# EAGLE design LightSwitch (EAGLE 8.7.0)
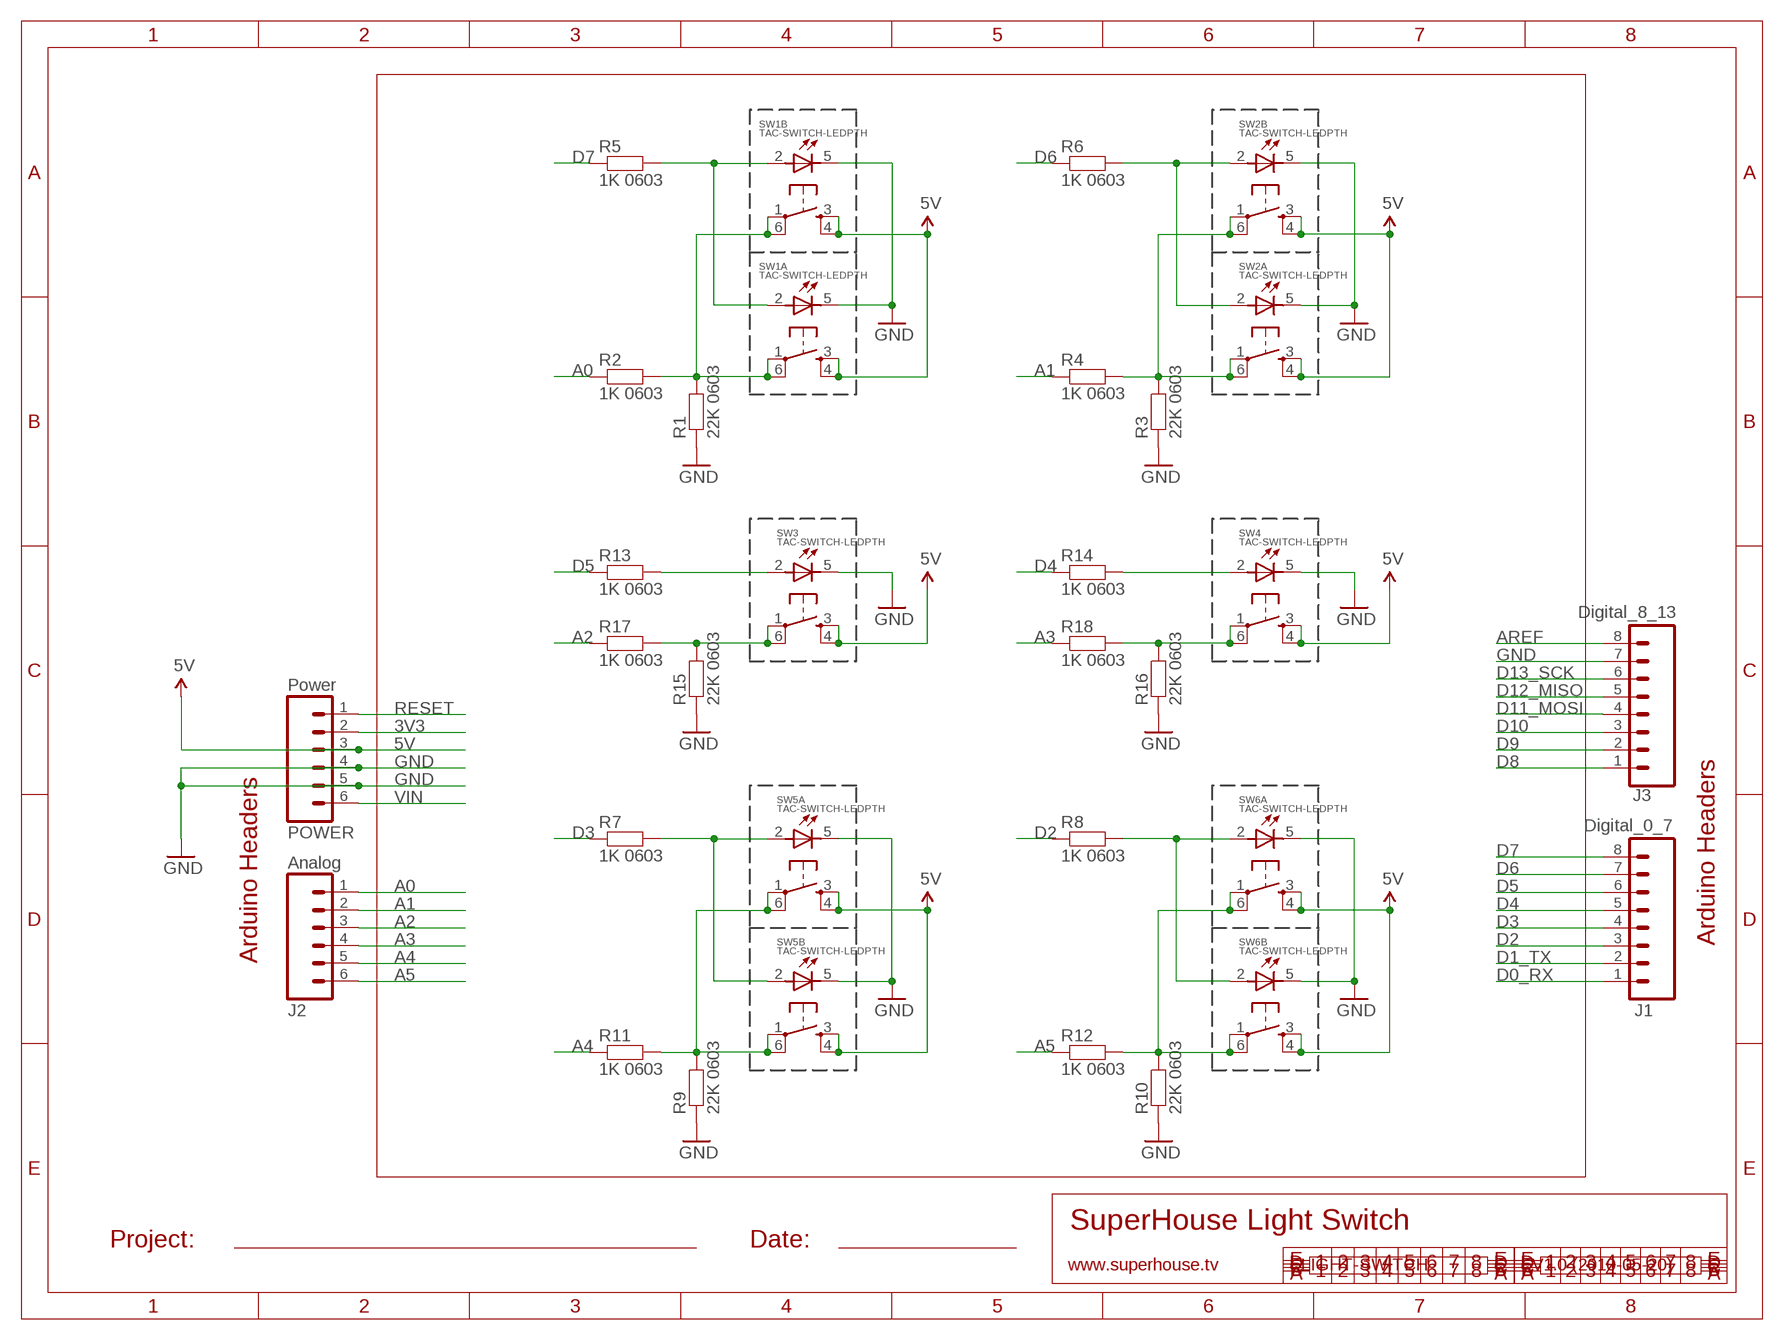
[diagram p0: schematic, sheet 1]

## Parts
J1  Digital_0_7  M08  [1X08]
J2  Analog  M06SIP  [1X06]
J3  Digital_8_13  M08  [1X08]
POWER  Power  M06SIP  [1X06]
R1  22K 0603  RESISTOR0603  [0603]
R2  1K 0603  RESISTOR0603  [0603]
R3  22K 0603  RESISTOR0603  [0603]
R4  1K 0603  RESISTOR0603  [0603]
R5  1K 0603  RESISTOR0603  [0603]
R6  1K 0603  RESISTOR0603  [0603]
R7  1K 0603  RESISTOR0603  [0603]
R8  1K 0603  RESISTOR0603  [0603]
R9  22K 0603  RESISTOR0603  [0603]
R10  22K 0603  RESISTOR0603  [0603]
R11  1K 0603  RESISTOR0603  [0603]
R12  1K 0603  RESISTOR0603  [0603]
R13  1K 0603  RESISTOR0603  [0603]
R14  1K 0603  RESISTOR0603  [0603]
R15  22K 0603  RESISTOR0603  [0603]
R16  22K 0603  RESISTOR0603  [0603]
R17  1K 0603  RESISTOR0603  [0603]
R18  1K 0603  RESISTOR0603  [0603]
SW1A  TAC-SWITCH-LEDPTH  [TACTILE-LED]
SW1B  TAC-SWITCH-LEDPTH  [TACTILE-LED]
SW2A  TAC-SWITCH-LEDPTH  [TACTILE-LED]
SW2B  TAC-SWITCH-LEDPTH  [TACTILE-LED]
SW3  TAC-SWITCH-LEDPTH  [TACTILE-LED]
SW4  TAC-SWITCH-LEDPTH  [TACTILE-LED]
SW5A  TAC-SWITCH-LEDPTH  [TACTILE-LED]
SW5B  TAC-SWITCH-LEDPTH  [TACTILE-LED]
SW6A  TAC-SWITCH-LEDPTH  [TACTILE-LED]
SW6B  TAC-SWITCH-LEDPTH  [TACTILE-LED]

## Nets
3V3: POWER.2
5V: POWER.3 SW1A.3 SW1A.4 SW1B.3 SW1B.4 SW2A.3 SW2A.4 SW2B.3 SW2B.4 SW3.3 SW3.4 SW4.3 SW4.4 SW5A.3 SW5A.4 SW5B.3 SW5B.4 SW6A.3 SW6A.4 SW6B.3 SW6B.4
A0: J2.1 R2.1
A1: J2.2 R4.1
A2: J2.3 R17.1
A3: J2.4 R18.1
A4: J2.5 R11.1
A5: J2.6 R12.1
AREF: J3.8
D0_RX: J1.1
D1_TX: J1.2
D2: J1.3 R8.1
D3: J1.4 R7.1
D4: J1.5 R14.1
D5: J1.6 R13.1
D6: J1.7 R6.1
D7: J1.8 R5.1
D8: J3.1
D9: J3.2
D10: J3.3
D11_MOSI: J3.4
D12_MISO: J3.5
D13_SCK: J3.6
GND: J3.7 POWER.4 POWER.5 R1.1 R3.1 R9.1 R10.1 R15.1 R16.1 SW1A.5(C) SW1B.5(C) SW2A.5(C) SW2B.5(C) SW3.5(C) SW4.5(C) SW5A.5(C) SW5B.5(C) SW6A.5(C) SW6B.5(C)
N$1: R5.2 SW1A.2(A) SW1B.2(A)
N$2: R6.2 SW2A.2(A) SW2B.2(A)
N$3: R1.2 R2.2 SW1A.1 SW1A.6 SW1B.1 SW1B.6
N$4: R13.2 SW3.2(A)
N$5: R14.2 SW4.2(A)
N$6: R7.2 SW5A.2(A) SW5B.2(A)
N$7: R3.2 R4.2 SW2A.1 SW2A.6 SW2B.1 SW2B.6
N$8: R8.2 SW6A.2(A) SW6B.2(A)
N$9: R15.2 R17.2 SW3.1 SW3.6
N$11: R16.2 R18.2 SW4.1 SW4.6
N$15: R9.2 R11.2 SW5A.1 SW5A.6 SW5B.1 SW5B.6
N$17: R10.2 R12.2 SW6A.1 SW6A.6 SW6B.1 SW6B.6
RESET: POWER.1
VIN: POWER.6

## Notes on the sheet
- Arduino Headers
- Arduino Headers
- SuperHouse Light Switch
- Project: | Date:
- www.superhouse.tv | LIGHT-SWITCH | V1.0 (2010-05-20)

## Library data of the parts
J1 J3 = freetronics:M08: Header 8 Standard 8-pin 0.1" header. Use with straight break away headers (SKU : PRT-00116), right angle break away headers (PRT-00553), swiss pins (PRT-00743), machine pins (PRT-00117), and female headers (PRT-00115).
J2 POWER = freetronics:M06: Header 6 Standard 6-pin 0.1" header. Use with straight break away headers (SKU : PRT-00116), right angle break away headers (PRT-00553), swiss pins (PRT-00743), machine pins (PRT-00117), and female headers (PRT-00115). Molex polarized connector foot print use with SKU : PRT-08094 with associated crimp pins and housings. NOTES ON THE VARIANTS LOCK and LOCK_LONGPADS... This footprint was designed to help hold the alignment of a through-hole component (i.e. 6-pin header) while soldering it into place. You may notice that each hole has been shifted either up or down by 0.005 of an inch from it's more standard position (which is a perfectly straight line). This slight alteration caused the pins (the squares in the middle) to touch the edges of the holes. Because they are alternating, it causes a "brace" to hold the component in place. 0.005 has proven to be the perfect amount of "off-center" position when using our standard breakaway headers. Although looks a little odd when you look at the bare footprint, once you have a header in there, the alteration is very hard to notice. Also, if you push a header all the way into place, it is covered up entirely on the bottom side. This idea of altering the position of holes to aid alignment will be further integrated into the Sparkfun Library for other footprints. It can help hold any component with 3 or more connection pins.
R1-R18 = freetronics-marc:RESISTOR: Resistor Basic schematic elements and footprints for 0603, 1206, and PTH 1/10th watt (small) resistors.
SW1A SW1B SW2A SW2B SW3 SW4 SW5A SW5B SW6A SW6B = freetronics-jon:TAC-SWITCH-LED: Tactile button with LED illumination

## Board
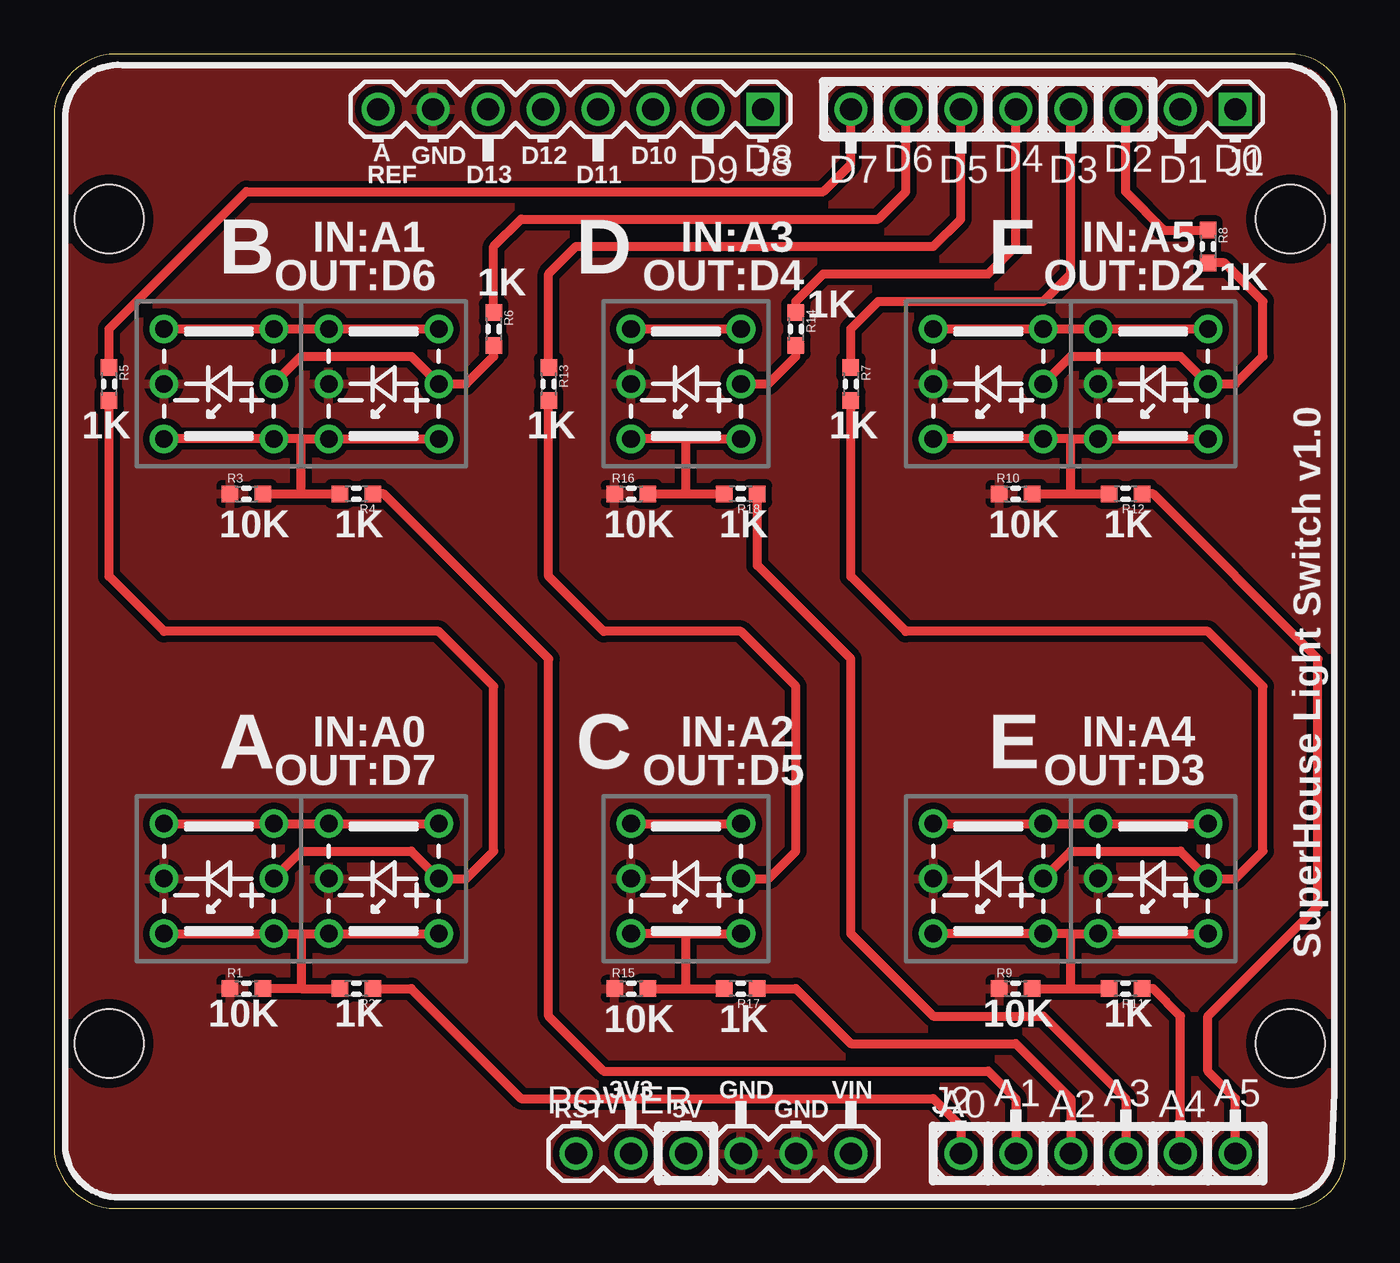
[diagram p1: board, top side]
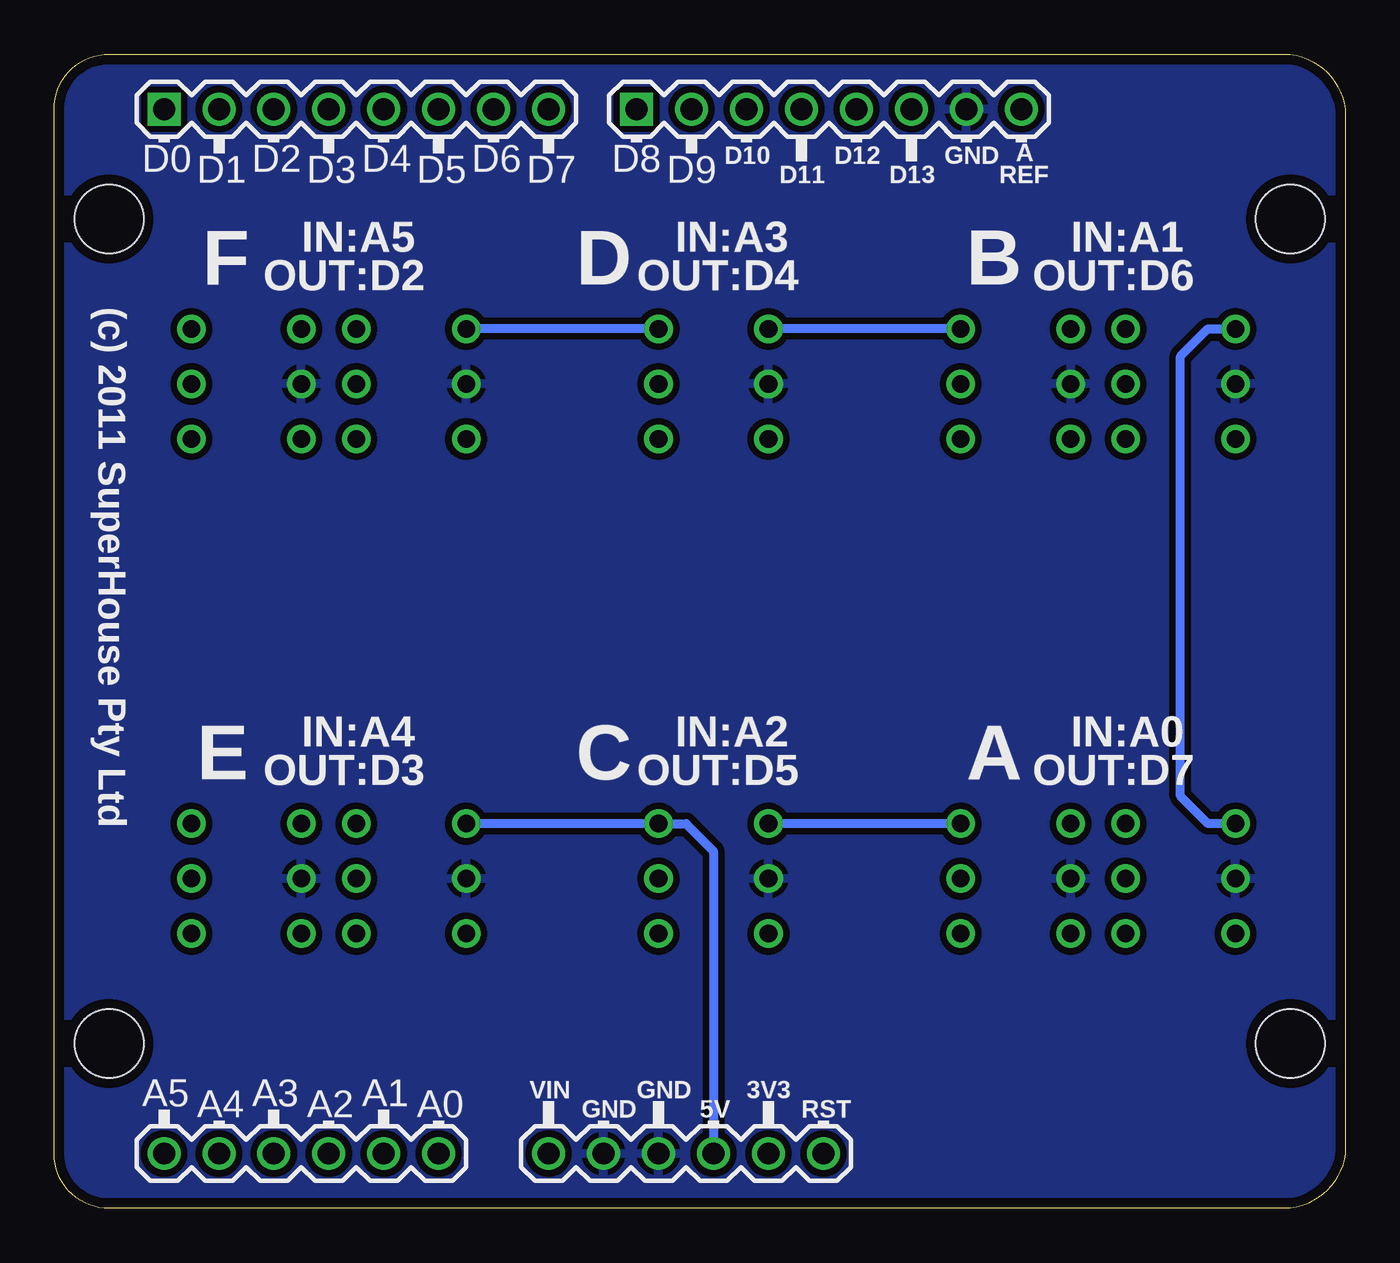
[diagram p2: board, bottom side, seen from below]

Size 59.69 x 53.34 mm. Coordinates in mm from the lower left corner, seen from the top.
Outline: 0,2.54 arc74 2.54,0 57.15,0 arc90 59.69,2.54 59.69,50.8 arc90 57.15,53.34 2.54,53.34 arc74 0,50.8 0,2.54
Copper layers (1*16): Top 0.035mm / dielectric 1.5mm / Bottom 0.035mm
Design rules "default": minimum track width 10mil, minimum drill 24mil, track to track 12mil, track to pad 12mil, pad to pad 12mil, via to via 12mil, smd to smd 8mil, copper to edge 18mil, drill to drill 8mil, minimum pad ring 10mil, minimum via ring 8mil, stop-mask expansion 4mil, vias tented up to drill 0mil, thermal gap 10mil
Holes 3.17 mm at 57.15,45.72 2.54,45.72 2.54,7.62 57.15,7.62

### Footprints (pad centres in the part's own frame; a part is rotated, then mirrored left to right if it is on the bottom)
1X08 = drill 1.016 square: 1 0,0 | drill 1.016: 2 2.54,0; 3 5.08,0; 4 7.62,0; 5 10.16,0; 6 12.7,0; 7 15.24,0; 8 17.78,0
1X06 = drill 1.016: 1 0,0; 2 2.54,0; 3 5.08,0; 4 7.62,0; 5 10.16,0; 6 12.7,0
0603 = smd 0.762 x 0.762: 1 -0.762,0; 2 0.762,0
TACTILE-LED = drill 0.813: 1 -2.54,2.54; 2 -2.54,0; 3 -2.54,-2.54; 4 2.54,-2.54; 5 2.54,0; 6 2.54,2.54

### Placement (x,y rotation side)
J1  54.61,50.8 180 top
J2  41.91,2.54 0 top
J3  32.77,50.8 180 top
POWER  24.13,2.54 0 top
R1  8.89,10.16 0 top
R2  13.97,10.16 180 top
R3  8.89,33.02 0 top
R4  13.97,33.02 180 top
R5  2.54,38.1 270 top
R6  20.32,40.64 270 top
R7  36.83,38.1 270 top
R8  53.34,44.45 270 top
R9  44.45,10.16 0 top
R10  44.45,33.02 0 top
R11  49.53,10.16 180 top
R12  49.53,33.02 180 top
R13  22.86,38.1 270 top
R14  34.29,40.64 270 top
R15  26.67,10.16 0 top
R16  26.67,33.02 0 top
R17  31.75,10.16 180 top
R18  31.75,33.02 180 top
SW1A  15.24,15.24 180 top
SW1B  7.62,15.24 180 top
SW2A  15.24,38.1 180 top
SW2B  7.62,38.1 180 top
SW3  29.21,15.24 180 top
SW4  29.21,38.1 180 top
SW5A  43.18,15.24 180 top
SW5B  50.8,15.24 180 top
SW6A  43.18,38.1 180 top
SW6B  50.8,38.1 180 top

### Tracks (layer width: path | path; a pad name or v marks a point on that pad's centre or on a via)
5V
  Top 0.406: SW1B.4 SW1B.3 SW1A.4 SW1A.3 | SW2B.4 SW2B.3 SW2A.4 SW2A.3 | SW3.4 SW3.3 | SW4.4 SW4.3 | SW5B.3 SW5B.4 SW5A.3 SW5A.4 | SW6A.4 SW6A.3 SW6B.4 SW6B.3
  Bottom 0.406: SW1A.3 SW3.4 | SW5A.4 SW3.3 30.48,17.78 29.21,16.51 POWER.3 | SW4.3 SW6A.4 | SW2A.3 SW4.4 | SW2B.4 6.35,40.64 7.62,39.37 7.62,19.05 6.35,17.78 SW1B.4
A0
  Top 0.406: J2.1 41.91,3.81 40.64,5.08 21.59,5.08 16.51,10.16 R2.1
A1
  Top 0.406: J2.2 44.45,5.08 43.18,6.35 25.4,6.35 22.86,8.89 22.86,25.4 15.24,33.02 R4.1
A2
  Top 0.406: J2.3 46.99,5.08 44.45,7.62 36.83,7.62 34.29,10.16 R17.1
A3
  Top 0.406: J2.4 49.53,5.08 45.72,8.89 40.64,8.89 36.83,12.7 36.83,25.4 32.51,29.72 R18.1
A4
  Top 0.406: J2.5 52.07,8.89 50.8,10.16 R11.1
A5
  Top 0.406: R12.1 50.8,33.02 58.42,25.4 58.42,13.97 53.34,8.89 53.34,6.35 54.61,5.08 J2.6
D2
  Top 0.406: R8.1 51.31,45.21 49.53,46.99 J1.3
D3
  Top 0.406: J1.4 46.99,43.18 45.72,41.91 38.1,41.91 36.83,40.64 R7.1
D4
  Top 0.406: R14.1 34.29,41.91 35.56,43.18 43.18,43.18 44.45,44.45 J1.5
D5
  Top 0.406: J1.6 41.91,45.72 40.64,44.45 24.13,44.45 22.86,43.18 R13.1
D6
  Top 0.406: J1.7 39.37,46.99 38.1,45.72 21.59,45.72 20.32,44.45 R6.1
D7
  Top 0.406: J1.8 36.83,48.26 35.56,46.99 8.89,46.99 2.54,40.64 R5.1
GND
  pour Bottom: 0,50.8 arc-74 2.54,53.34 57.15,53.34 arc-74 59.69,50.8 59.69,2.54 arc-74 57.15,0 2.54,0 arc-74 0,2.54
  pour Top: 0,50.8 arc-74 2.54,53.34 57.15,53.34 arc-74 59.69,50.8 59.69,2.54 arc-74 57.15,0 2.54,0 arc-74 0,2.54
N$1
  Top 0.406: SW1B.2 11.43,16.51 16.51,16.51 SW1A.2 19.05,15.24 20.32,16.51 20.32,24.13 17.78,26.67 5.08,26.67 2.54,29.21 R5.2
N$2
  Top 0.406: SW2B.2 11.43,39.37 16.51,39.37 SW2A.2 19.05,38.1 20.32,39.37 R6.2
N$3
  Top 0.406: 11.43,12.7 SW1B.1 SW1B.6 | 11.43,12.7 SW1A.6 SW1A.1 | 11.43,10.16 R1.2 | 11.43,10.16 R2.2 | 11.43,12.7 11.43,10.16
N$4
  Top 0.406: R13.2 22.86,29.21 25.4,26.67 31.75,26.67 34.29,24.13 34.29,16.51 33.02,15.24 SW3.2
N$5
  Top 0.406: R14.2 34.29,39.37 33.02,38.1 SW4.2
N$6
  Top 0.406: SW5A.2 46.99,16.51 52.07,16.51 SW5B.2 54.61,15.24 55.88,16.51 55.88,24.13 53.34,26.67 39.37,26.67 36.83,29.21 R7.2
N$7
  Top 0.406: 11.43,35.56 SW2B.1 SW2B.6 | 11.43,35.56 SW2A.6 SW2A.1 | R3.2 11.43,33.02 | 11.43,33.02 R4.2 | 11.43,33.02 11.43,35.56
N$8
  Top 0.406: SW6A.2 46.99,39.37 52.07,39.37 SW6B.2 54.61,38.1 55.88,39.37 55.88,41.91 54.1,43.69 R8.2
N$9
  Top 0.406: 29.21,12.7 SW3.1 | 29.21,12.7 SW3.6 | R15.2 29.21,10.16 | 29.21,10.16 29.21,12.7 | 29.21,10.16 R17.2
N$11
  Top 0.406: 29.21,35.56 SW4.1 | 29.21,35.56 SW4.6 | R16.2 29.21,33.02 | 29.21,33.02 29.21,35.56 | 29.21,33.02 R18.2
N$15
  Top 0.406: 46.99,12.7 SW5A.1 SW5A.6 | 46.99,12.7 SW5B.6 SW5B.1 | R9.2 46.99,10.16 | 46.99,10.16 R11.2 | 46.99,10.16 46.99,12.7
N$17
  Top 0.406: 46.99,35.56 SW6A.1 SW6A.6 | 46.99,35.56 SW6B.6 SW6B.1 | R10.2 46.99,33.02 | 46.99,33.02 R12.2 | 46.99,33.02 46.99,35.56

### Text on the board
tPlace: A | GND | D12 | D10 | D8 | D6 | D4 | D2 | D0 | REF | D13 | D11 | D9 | D7 | D5 | D3 | D1 | IN:A1 | IN:A3 | IN:A5 | B | D | F | OUT:D6 | 1K | OUT:D4 | OUT:D2 | 1K | 1K | 1K | 1K | 1K | 10K | 1K | 10K | 1K | 10K | 1K | IN:A0 | IN:A2 | IN:A4 | A | OUT:D7 | C | OUT:D5 | E | OUT:D3 | SuperHouse Light Switch v1.0 | 10K | 1K | 10K | 1K | 10K | 1K | 3V3 | GND | VIN | A1 | A3 | A5 | RST | 5V | GND | A0 | A2 | A4
bPlace: A | GND | D12 | D10 | D8 | D6 | D4 | D2 | D0 | REF | D13 | D11 | D9 | D7 | D5 | D3 | D1 | IN:A1 | IN:A3 | IN:A5 | B | D | F | OUT:D6 | OUT:D4 | OUT:D2 | (c) 2011 SuperHouse Pty Ltd | IN:A0 | IN:A2 | IN:A4 | OUT:D7 | A | OUT:D5 | C | OUT:D3 | E | 3V3 | GND | VIN | A1 | A3 | A5 | RST | 5V | GND | A0 | A2 | A4